# Altium schematic sheet [08] - MCU.SchDoc
size A3; DocumentNumber: 8; SheetNumber: 8; SheetTotal: 9
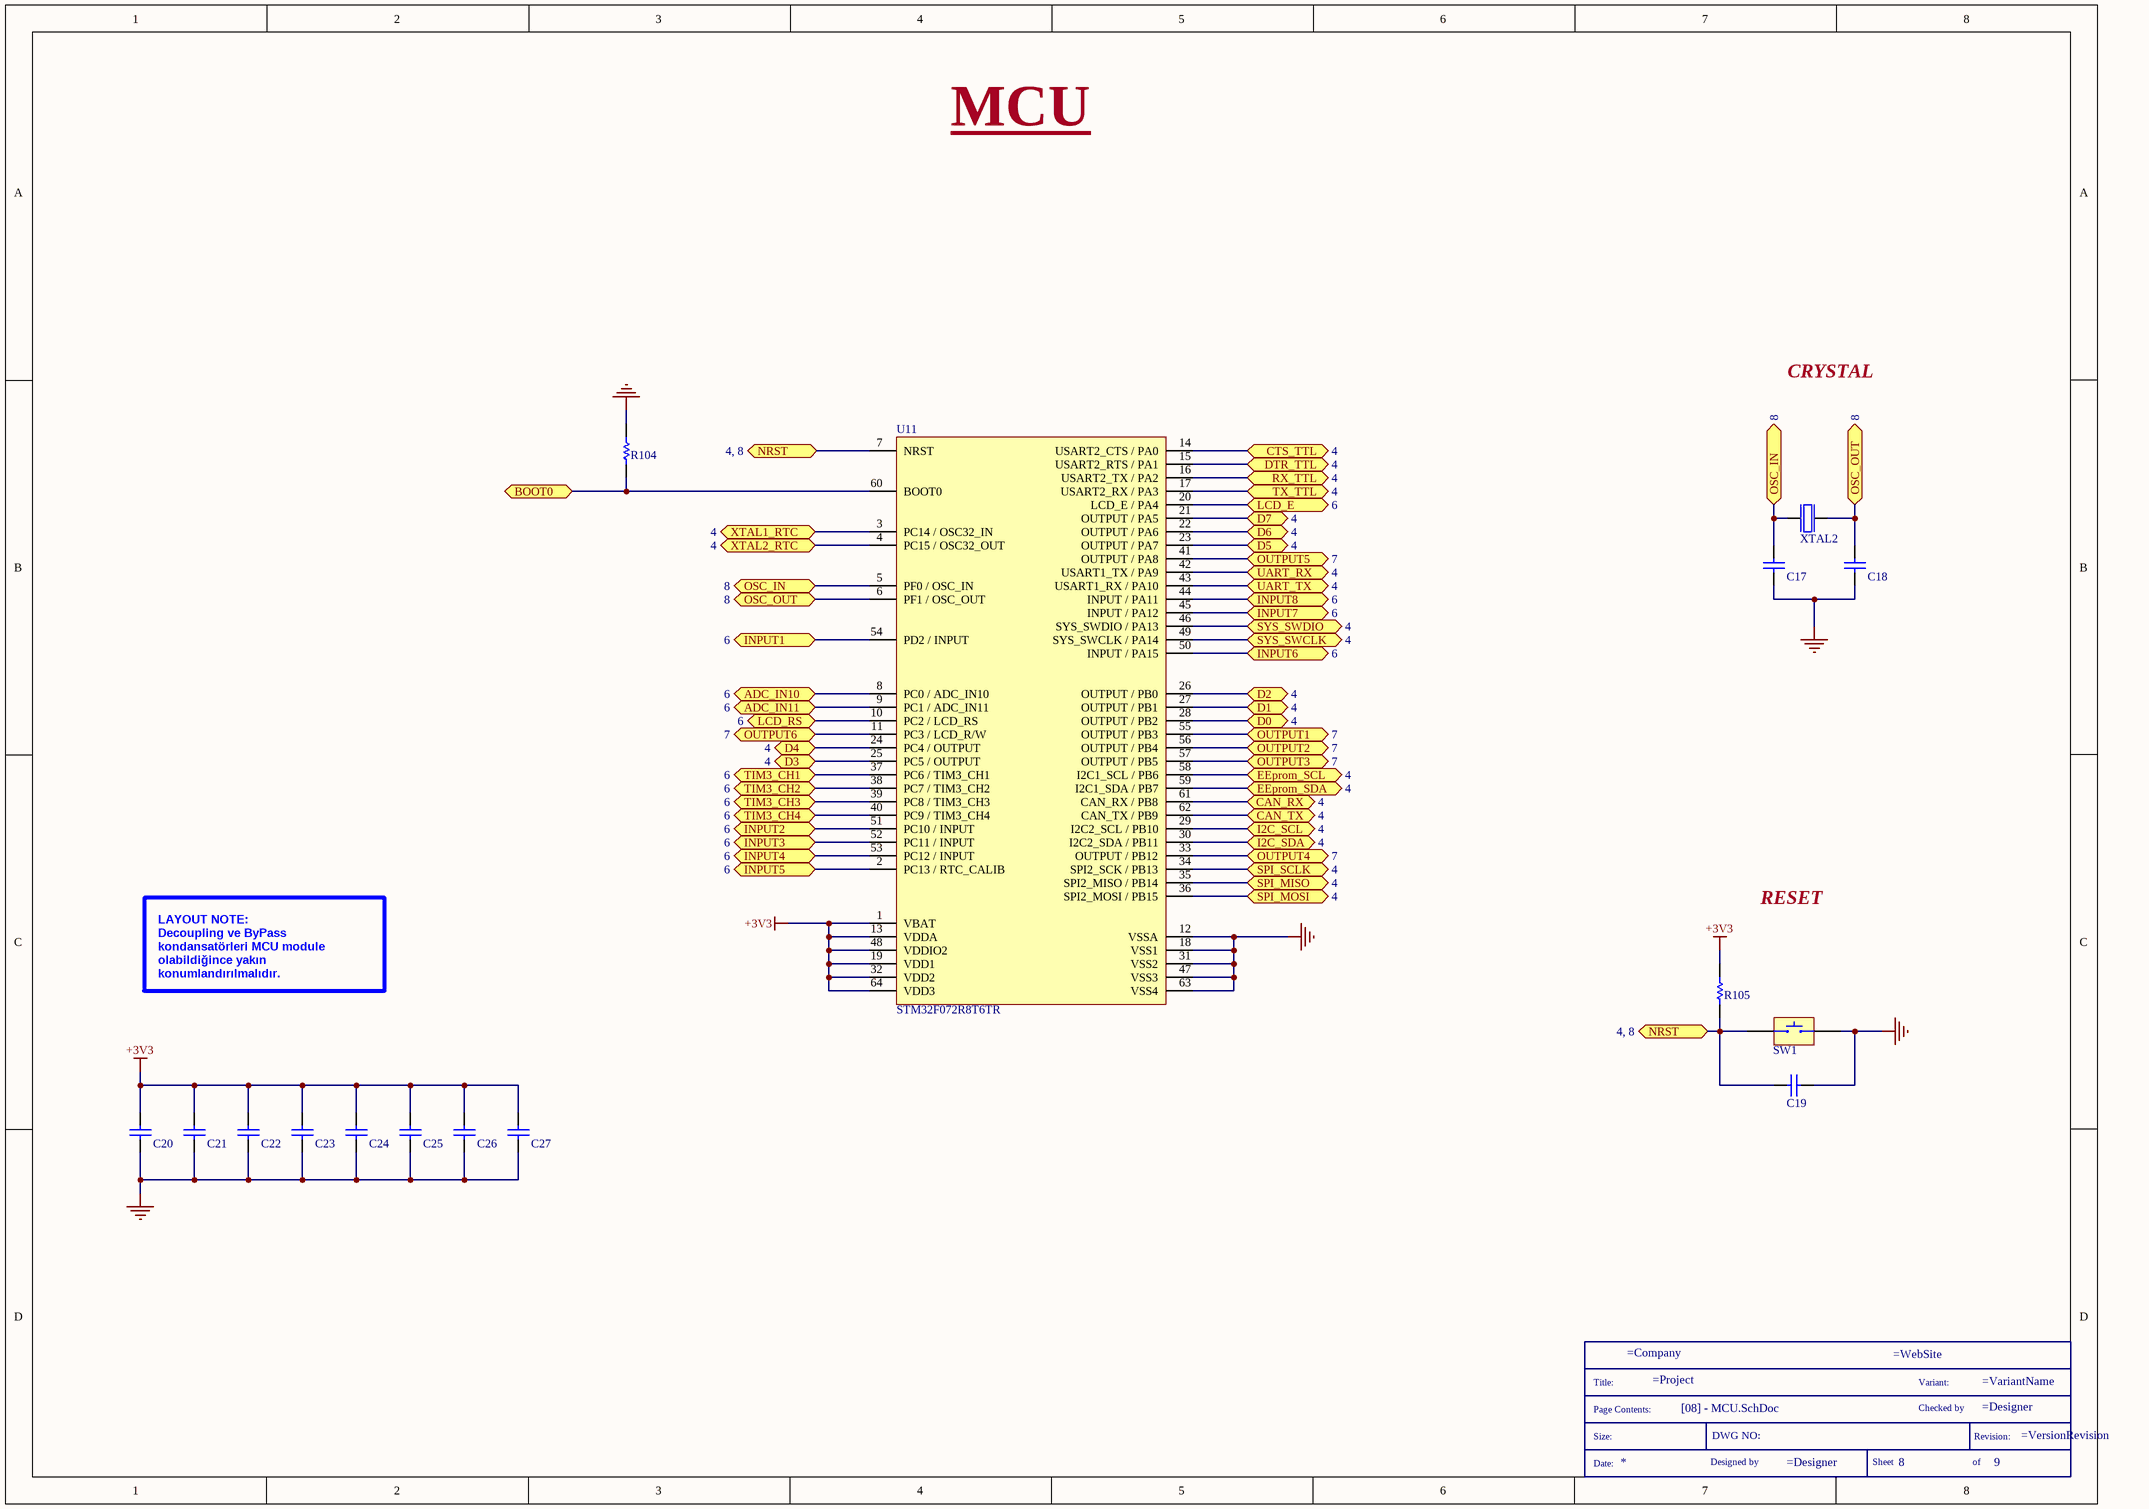
[diagram p0: [08] - MCU.SchDoc]

## Parts
*  SCH_TITLE  (value not drawn)  (graphical)
C17  22pF 100V  [CAP_CER_0603]  (value not drawn)
C18  22pF 100V  [CAP_CER_0603]  (value not drawn)
C19  100nF 35V  [CAP_CER_0603]  (value not drawn)
C20  100nF 35V  [CAP_CER_0603]  (value not drawn)
C21  100nF 35V  [CAP_CER_0603]  (value not drawn)
C22  100nF 35V  [CAP_CER_0603]  (value not drawn)
C23  100nF 35V  [CAP_CER_0603]  (value not drawn)
C24  1uF 35V  [C0603]  (value not drawn)
C25  10nF 100V  [CAP_CER_0805]  (value not drawn)
C26  4.7uF 35V  [CAP_CER_0805]  (value not drawn)
C27  4.7uF 35V  [CAP_CER_0805]  (value not drawn)
R104  5.6k 1/8W  [RES_0805]  (value not drawn)
R105  5.6k 1/8W  [RES_0805]  (value not drawn)
SW1  TAC SW  [TAC-SW]  (value not drawn)
U11  STM32F072R8T6TR  [LQFP64]
XTAL2  8.000MHZ  [XTAL_4SMD]  (value not drawn)

## Ports
ADC_IN10 (see 6), ADC_IN11 (see 6), BOOT0, CAN_RX (see 4), CAN_TX (see 4), CTS_TTL (see 4), D0 (see 4), D1 (see 4), D2 (see 4), D3 (see 4), D4 (see 4), D5 (see 4), D6 (see 4), D7 (see 4), DTR_TTL (see 4), EEprom_SCL (see 4), EEprom_SDA (see 4), I2C_SCL (see 4), I2C_SDA (see 4), INPUT1 (see 6), INPUT2 (see 6), INPUT3 (see 6), INPUT4 (see 6), INPUT5 (see 6), INPUT6 (see 6), INPUT7 (see 6), INPUT8 (see 6), LCD_E (see 6), LCD_RS (see 6), NRST (see 4, 8), OSC_IN (see 8), OSC_OUT (see 8), OUTPUT1 (see 7), OUTPUT2 (see 7), OUTPUT3 (see 7), OUTPUT4 (see 7), OUTPUT5 (see 7), OUTPUT6 (see 7), RX_TTL (see 4), SPI_MISO (see 4), SPI_MOSI (see 4), SPI_SCLK (see 4), SYS_SWCLK (see 4), SYS_SWDIO (see 4), TIM3_CH1 (see 6), TIM3_CH2 (see 6), TIM3_CH3 (see 6), TIM3_CH4 (see 6), TX_TTL (see 4), UART_RX (see 4), UART_TX (see 4), XTAL1_RTC (see 4), XTAL2_RTC (see 4)

## Nets
+3V3: C20.2 C21.2 C22.2 C23.2 C24.2 C25.2 C26.2 C27.2 R105.2 U11.1(VBAT) U11.13(VDDA) U11.19(VDD1) U11.32(VDD2) U11.48(VDDIO2) U11.64(VDD3)
GND: C17.1 C18.1 C19.2 C20.1 C21.1 C22.1 C23.1 C24.1 C25.1 C26.1 C27.1 R104.2 SW1.2 U11.12(VSSA) U11.18(VSS1) U11.31(VSS2) U11.47(VSS3) U11.63(VSS4)
ADC_IN10: U11.8(PC0_/_ADC_IN10) ; port ADC_IN10
ADC_IN11: U11.9(PC1_/_ADC_IN11) ; port ADC_IN11
BOOT0: R104.1 U11.60(BOOT0) ; port BOOT0
CAN_RX: U11.61(CAN_RX_/_PB8) ; port CAN_RX
CAN_TX: U11.62(CAN_TX_/_PB9) ; port CAN_TX
CTS_TTL: U11.14(USART2_CTS_/_PA0) ; port CTS_TTL
D0: U11.28(OUTPUT_/_PB2) ; port D0
D1: U11.27(OUTPUT_/_PB1) ; port D1
D2: U11.26(OUTPUT_/_PB0) ; port D2
D3: U11.25(PC5_/_OUTPUT) ; port D3
D4: U11.24(PC4_/_OUTPUT) ; port D4
D5: U11.23(OUTPUT_/_PA7) ; port D5
D6: U11.22(OUTPUT_/_PA6) ; port D6
D7: U11.21(OUTPUT_/_PA5) ; port D7
DTR_TTL: U11.15(USART2_RTS_/_PA1) ; port DTR_TTL
EEprom_SCL: U11.58(I2C1_SCL_/_PB6) ; port EEprom_SCL
EEprom_SDA: U11.59(I2C1_SDA_/_PB7) ; port EEprom_SDA
I2C_SCL: U11.29(I2C2_SCL_/_PB10) ; port I2C_SCL
I2C_SDA: U11.30(I2C2_SDA_/_PB11) ; port I2C_SDA
INPUT1: U11.54(PD2_/_INPUT) ; port INPUT1
INPUT2: U11.51(PC10_/_INPUT) ; port INPUT2
INPUT3: U11.52(PC11_/_INPUT) ; port INPUT3
INPUT4: U11.53(PC12_/_INPUT) ; port INPUT4
INPUT5: U11.2(PC13_/_RTC_CALIB) ; port INPUT5
INPUT6: U11.50(INPUT_/_PA15) ; port INPUT6
INPUT7: U11.45(INPUT_/_PA12) ; port INPUT7
INPUT8: U11.44(INPUT_/_PA11) ; port INPUT8
LCD_E: U11.20(LCD_E_/_PA4) ; port LCD_E
LCD_RS: U11.10(PC2_/_LCD_RS) ; port LCD_RS
NRST: C19.1 R105.1 SW1.1 U11.7(NRST) ; port NRST
OSC_IN: C17.2 U11.5(PF0_/_OSC_IN) XTAL2.3 ; port OSC_IN
OSC_OUT: C18.2 U11.6(PF1_/_OSC_OUT) XTAL2.1 ; port OSC_OUT
OUTPUT1: U11.55(OUTPUT_/_PB3) ; port OUTPUT1
OUTPUT2: U11.56(OUTPUT_/_PB4) ; port OUTPUT2
OUTPUT3: U11.57(OUTPUT_/_PB5) ; port OUTPUT3
OUTPUT4: U11.33(OUTPUT_/_PB12) ; port OUTPUT4
OUTPUT5: U11.41(OUTPUT_/_PA8) ; port OUTPUT5
OUTPUT6: U11.11(PC3_/_LCD_R/W) ; port OUTPUT6
RX_TTL: U11.16(USART2_TX_/_PA2) ; port RX_TTL
SPI_MISO: U11.35(SPI2_MISO_/_PB14) ; port SPI_MISO
SPI_MOSI: U11.36(SPI2_MOSI_/_PB15) ; port SPI_MOSI
SPI_SCLK: U11.34(SPI2_SCK_/_PB13) ; port SPI_SCLK
SYS_SWCLK: U11.49(SYS_SWCLK_/_PA14) ; port SYS_SWCLK
SYS_SWDIO: U11.46(SYS_SWDIO_/_PA13) ; port SYS_SWDIO
TIM3_CH1: U11.37(PC6_/_TIM3_CH1) ; port TIM3_CH1
TIM3_CH2: U11.38(PC7_/_TIM3_CH2) ; port TIM3_CH2
TIM3_CH3: U11.39(PC8_/_TIM3_CH3) ; port TIM3_CH3
TIM3_CH4: U11.40(PC9_/_TIM3_CH4) ; port TIM3_CH4
TX_TTL: U11.17(USART2_RX_/_PA3) ; port TX_TTL
UART_RX: U11.42(USART1_TX_/_PA9) ; port UART_RX
UART_TX: U11.43(USART1_RX_/_PA10) ; port UART_TX
XTAL1_RTC: U11.3(PC14_/_OSC32_IN) ; port XTAL1_RTC
XTAL2_RTC: U11.4(PC15_/_OSC32_OUT) ; port XTAL2_RTC

## Notes on the sheet
- MCU
- CRYSTAL
- RESET
- LAYOUT NOTE:
  Decoupling ve ByPass kondansatörleri MCU module olabildiğince yakın konumlandırılmalıdır.
- (in symbol SCH_TITLE) Title:; Variant:; Page Contents:; Checked by; Size:; DWG NO:; Revision:; Date:; Designed by; Sheet; of

## Library data of the parts
* = SCH_TITLE: Schematic information
C17 C18 = GCM1885C2A220FA16D: CAP CER 22PF 100V C0G/NP0 0603; Manufacturer 1: Murata Electronics North America; Category: Ceramic Capacitors; Manufacturer Part Number 1: GCM1885C2A220FA16D; Case/Package: 0603 (1608 Metric); Quantity: 1; Supplier 1: Digikey; Supplier Part Number 1: 490-16413-1-ND; Supplier Order Qty 1: 1; Supplier Stock 1: 22604; Supplier Unit Price 1: 0,22; Supplier Currency 1: $
C19-C23 = GMK107BJ104KAHT: CAP CER 100nf 35V X5R 0603; Manufacturer 1: Taiyo Yuden; Category: Ceramic Capacitors; Manufacturer Part Number 1: GMK107BJ104KAHT; Case/Package: 0603 (1608 Metric); Quantity: 1; Supplier 1: Digikey; Supplier Part Number 1: 587-3357-1-ND; Supplier Order Qty 1: 1; Supplier Stock 1: 97932; Supplier Unit Price 1: 0,14; Supplier Currency 1: $
C24 = CGA3E3X5R1V105K080AB: CAP CER 1UF 35V; Manufacturer 1: TDK Corporation; Category: Ceramic Capacitors; Manufacture Part Number 1: CGA3E3X5R1V105K080AB; Case/Package: 0603 (1608 Metric); Quantity: 1; Supplier 1: Digikey; Supplier Part Number 1: 445-12484-1-ND; Supplier Order Qty 1: 1; Supplier Stock 1: 11910; Supplier Unit Price 1: 0,25; Supplier Currency 1: $
C25 = CL21B103KC6WPNC: CAP CER 10nF 100V; Manufacturer 1: Samsung Electro-Mechanics; Category: Ceramic Capacitors; Manufacturer Part Number 1: CL21B103KC6WPNC; Case/Package: 0805 (2012 Metric); Quantity: 1; Supplier 1: Digikey; Supplier Part Number 1: 1276-6845-1-ND; Supplier Order Qty 1: 1; Supplier Stock 1: 38701; Supplier Unit Price 1: 0,1; Supplier Currency 1: $
C26 C27 = GRT21BC8YA475KE13L: CAP CER 100nf 35V X5R 0603; Manufacturer 1: Murata Electronics North America; Category: Ceramic Capacitors; Manufacturer Part Number 1: GRT21BC8YA475KE13L; Case/Package: 0805 (2012 Metric); Quantity: 1; Supplier 1: Digikey; Supplier Part Number 1: 490-12361-1-ND; Supplier Order Qty 1: 1; Supplier Stock 1: 5076; Supplier Unit Price 1: 0,45; Supplier Currency 1: $
R104 R105 = ERJ-6ENF5601V: RES SMD 5.6K OHM 1% 1/8W 0805; Manufacturer 1: Panasonic Electronic Components; Category: Chip Resistor - Surface Mount; Manufacturer Part Number 1: ERJ-6ENF5601V; Case/Package: 0805 (2012 Metric); Quantity: 1; Supplier 1: Digikey; Supplier Part Number 1: P5.60KCCT-ND; Supplier Order Qty 1: 1; Supplier Stock 1: 71341; Supplier Unit Price 1: 0,1; Supplier Currency 1: $
SW1 = FSMSMTR: SWITCH TACTILE SPST-NO 0.05A 24V; Manufacturer 1: TE Connectivity ALCOSWITCH Switches; Category: Tactile Switches; Manufacturer Part Number 1: FSMSMTR; Case/Package: *; Quantity: 1; Supplier 1: Digikey; Supplier Part Number 1: 450-1758-1-ND; Supplier Order Qty 1: 1; Supplier Stock 1: 28743; Supplier Unit Price 1: 0,47; Supplier Currency 1: $
U11 = STM32F072R8T6TR: IC MCU 32BIT 64KB FLASH 64LQFP; Manufacturer 1: STMicroelectronics; Category: Embedded - Microcontrollers; Manufacture Part Number 1: STM32F072R8T6TR; Case/Package: 64-LQFP; Quantity: 1; Supplier 1: Digikey; Supplier Part Number 1: 497-17362-1-ND; Supplier Order Qty 1: 1; Supplier Stock 1: 441; Supplier Unit Price 1: 3,84; Supplier Currency 1: $
XTAL2 = ECS-80-18-20BQ-DS: CRYSTAL 8.000MHZ; Manufacturer 1: ECS Inc.; Category: Crystals; Manufacturer Part Number 1: ECS-80-18-20BQ-DS; Case/Package: 4-SMD, No Lead; Quantity: 1; Supplier 1: Digikey; Supplier Part Number 1: XC2015CT-ND; Supplier Order Qty 1: 1; Supplier Stock 1: 15309; Supplier Unit Price 1: 1,26; Supplier Currency 1: $